# EAGLE design Logic Engine - Front LED (EAGLE 6.6.0)
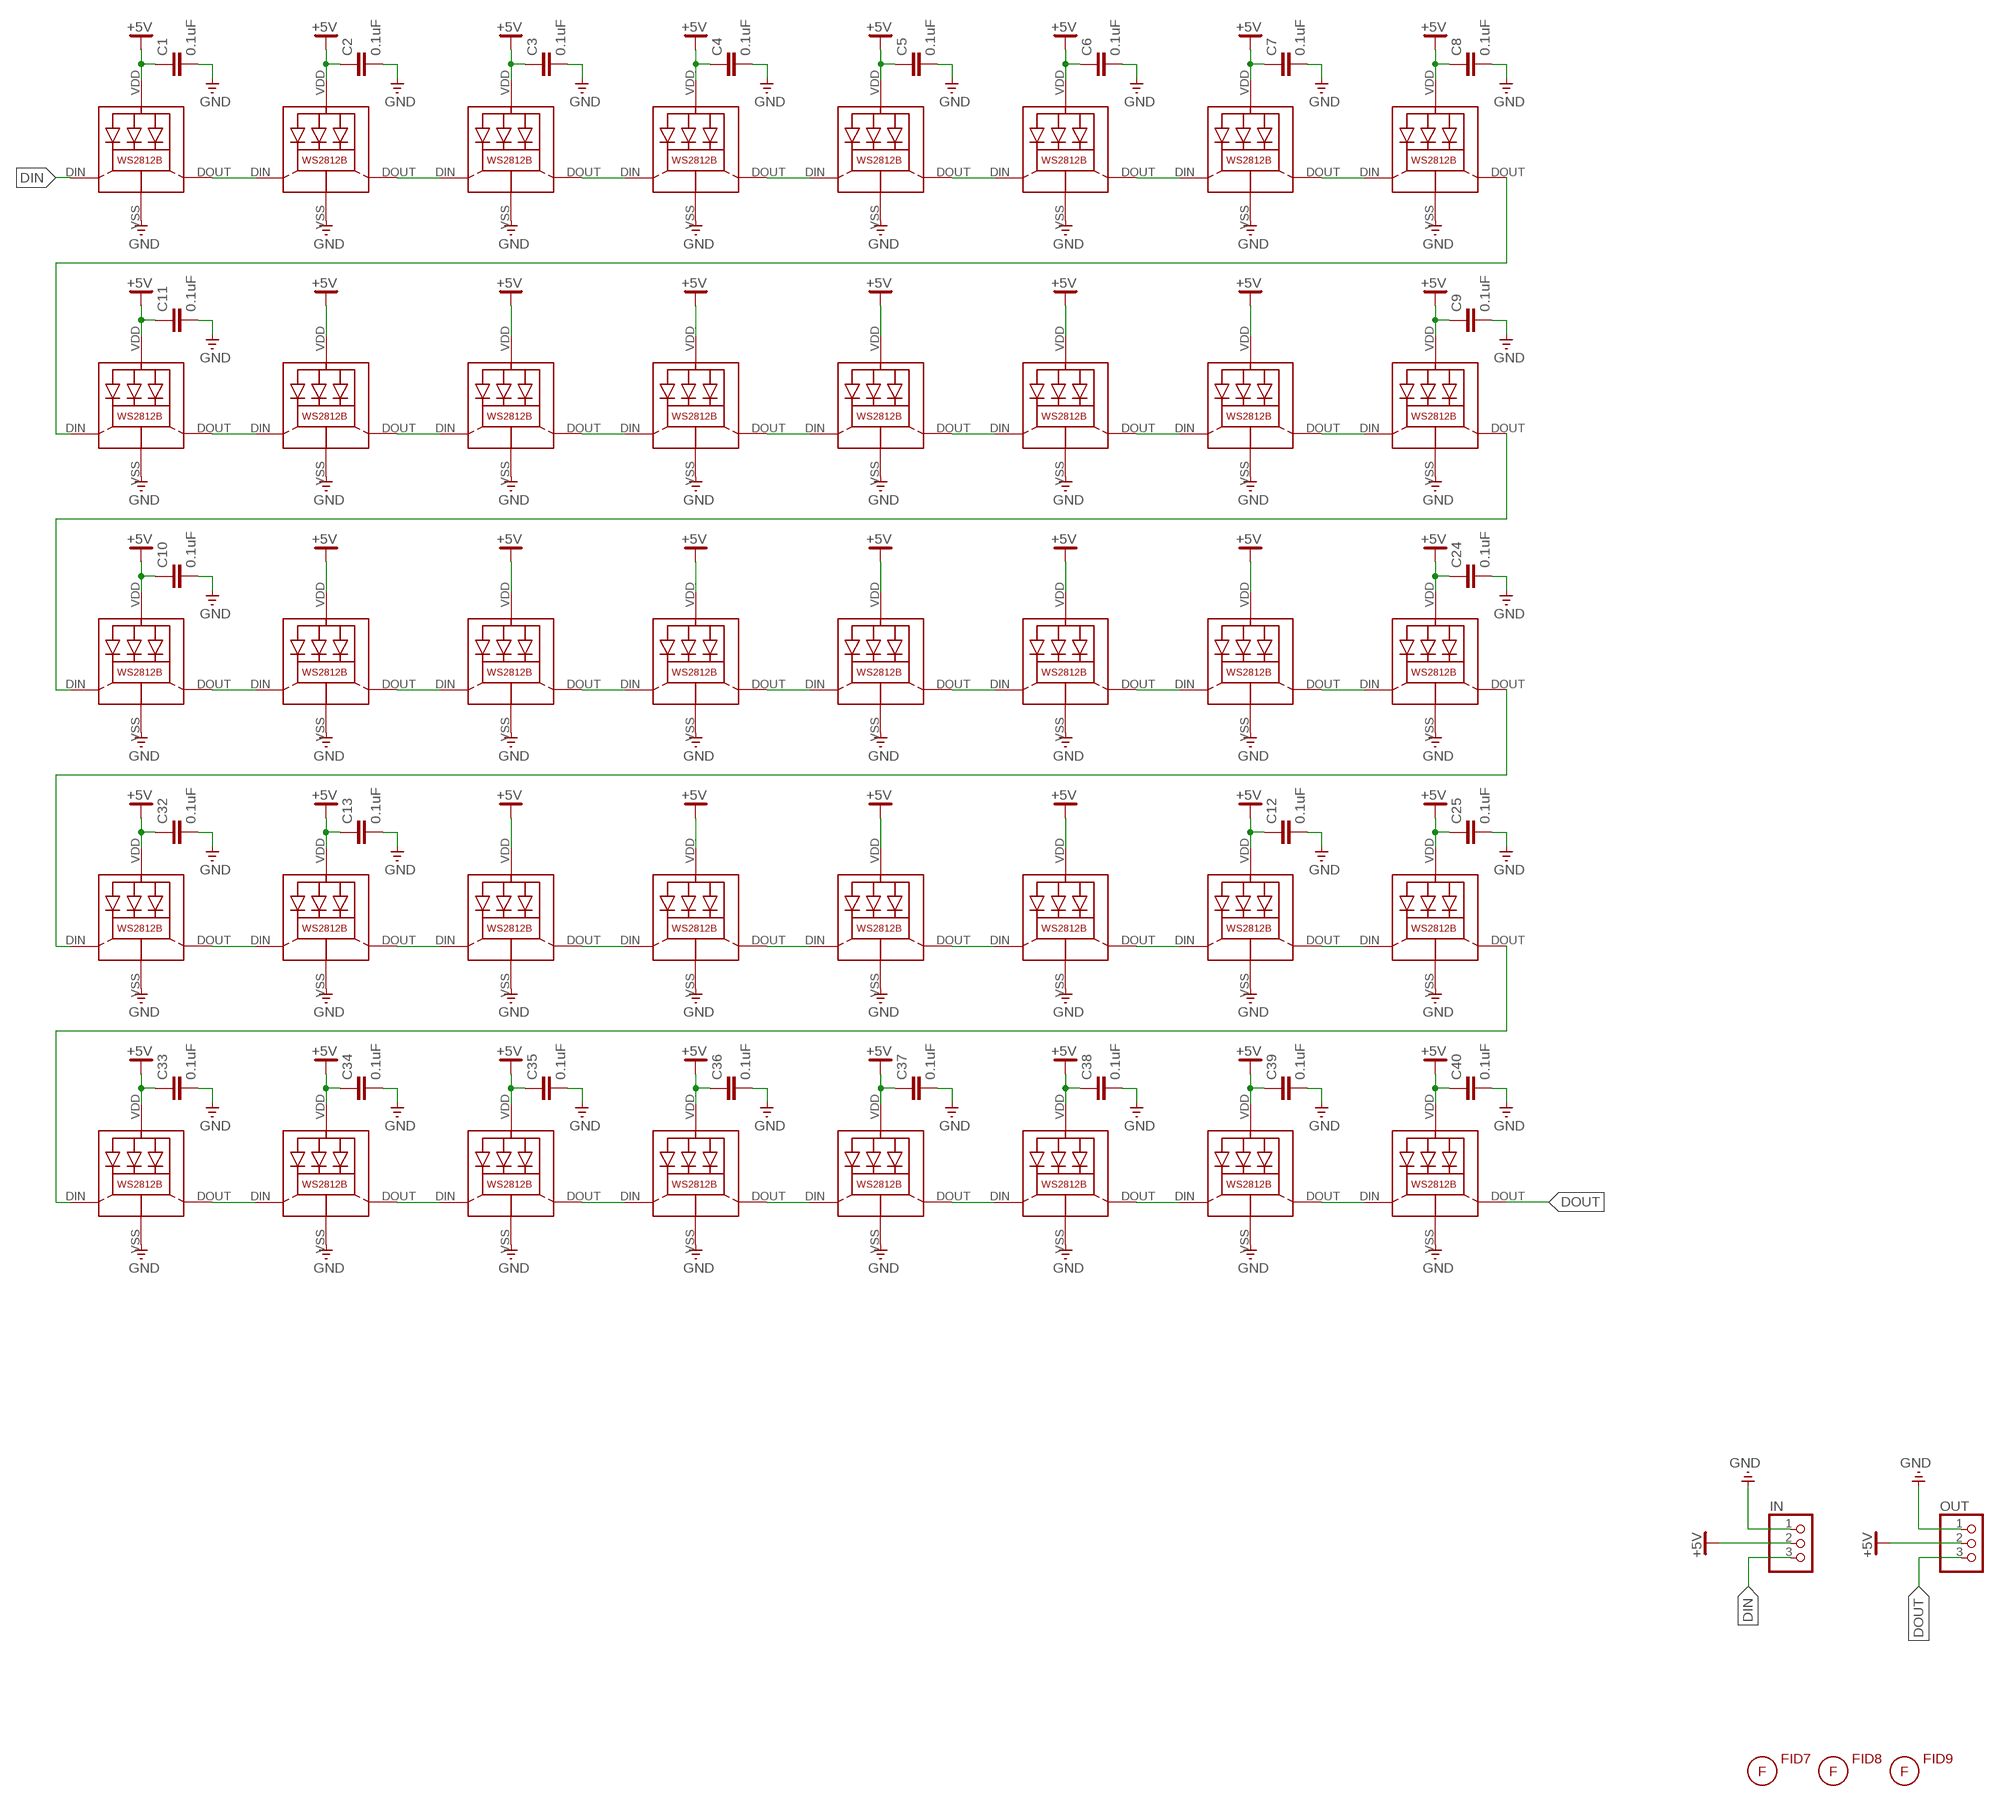
[diagram p0: schematic, sheet 1]

## Parts
C1  0.1uF  CAP0603-CAP  [0603-CAP]
C2  0.1uF  CAP0603-CAP  [0603-CAP]
C3  0.1uF  CAP0603-CAP  [0603-CAP]
C4  0.1uF  CAP0603-CAP  [0603-CAP]
C5  0.1uF  CAP0603-CAP  [0603-CAP]
C6  0.1uF  CAP0603-CAP  [0603-CAP]
C7  0.1uF  CAP0603-CAP  [0603-CAP]
C8  0.1uF  CAP0603-CAP  [0603-CAP]
C9  0.1uF  CAP0603-CAP  [0603-CAP]
C10  0.1uF  CAP0603-CAP  [0603-CAP]
C11  0.1uF  CAP0603-CAP  [0603-CAP]
C12  0.1uF  CAP0603-CAP  [0603-CAP]
C13  0.1uF  CAP0603-CAP  [0603-CAP]
C24  0.1uF  CAP0603-CAP  [0603-CAP]
C25  0.1uF  CAP0603-CAP  [0603-CAP]
C32  0.1uF  CAP0603-CAP  [0603-CAP]
C33  0.1uF  CAP0603-CAP  [0603-CAP]
C34  0.1uF  CAP0603-CAP  [0603-CAP]
C35  0.1uF  CAP0603-CAP  [0603-CAP]
C36  0.1uF  CAP0603-CAP  [0603-CAP]
C37  0.1uF  CAP0603-CAP  [0603-CAP]
C38  0.1uF  CAP0603-CAP  [0603-CAP]
C39  0.1uF  CAP0603-CAP  [0603-CAP]
C40  0.1uF  CAP0603-CAP  [0603-CAP]
FID7  FIDUCIAL  [FIDUCIAL_G15]
FID8  FIDUCIAL  [FIDUCIAL_G15]
FID9  FIDUCIAL  [FIDUCIAL_G15]
IN  PINHD-1X3  [1X03]
L1  WS2812B  [WS2812B]
L2  WS2812B  [WS2812B]
L3  WS2812B  [WS2812B]
L4  WS2812B  [WS2812B]
L5  WS2812B  [WS2812B]
L6  WS2812B  [WS2812B]
L7  WS2812B  [WS2812B]
L8  WS2812B  [WS2812B]
L9  WS2812B  [WS2812B]
L10  WS2812B  [WS2812B]
L11  WS2812B  [WS2812B]
L12  WS2812B  [WS2812B]
L13  WS2812B  [WS2812B]
L14  WS2812B  [WS2812B]
L15  WS2812B  [WS2812B]
L16  WS2812B  [WS2812B]
L17  WS2812B  [WS2812B]
L18  WS2812B  [WS2812B]
L19  WS2812B  [WS2812B]
L20  WS2812B  [WS2812B]
L21  WS2812B  [WS2812B]
L22  WS2812B  [WS2812B]
L23  WS2812B  [WS2812B]
L24  WS2812B  [WS2812B]
L25  WS2812B  [WS2812B]
L26  WS2812B  [WS2812B]
L27  WS2812B  [WS2812B]
L28  WS2812B  [WS2812B]
L29  WS2812B  [WS2812B]
L30  WS2812B  [WS2812B]
L31  WS2812B  [WS2812B]
L32  WS2812B  [WS2812B]
L33  WS2812B  [WS2812B]
L34  WS2812B  [WS2812B]
L35  WS2812B  [WS2812B]
L36  WS2812B  [WS2812B]
L37  WS2812B  [WS2812B]
L38  WS2812B  [WS2812B]
L39  WS2812B  [WS2812B]
L40  WS2812B  [WS2812B]
OUT  PINHD-1X3  [1X03]

## Nets
+5V [supply]: C1.1 C2.1 C3.1 C4.1 C5.1 C6.1 C7.1 C8.1 C9.1 C10.1 C11.1 C12.1 C13.1 C24.1 C25.1 C32.1 C33.1 C34.1 C35.1 C36.1 C37.1 C38.1 C39.1 C40.1 IN.2 L1.VDD L2.VDD L3.VDD L4.VDD L5.VDD L6.VDD L7.VDD L8.VDD L9.VDD L10.VDD L11.VDD L12.VDD L13.VDD L14.VDD L15.VDD L16.VDD L17.VDD L18.VDD L19.VDD L20.VDD L21.VDD L22.VDD L23.VDD L24.VDD L25.VDD L26.VDD L27.VDD L28.VDD L29.VDD L30.VDD L31.VDD L32.VDD L33.VDD L34.VDD L35.VDD L36.VDD L37.VDD L38.VDD L39.VDD L40.VDD OUT.2
DIN: IN.3 L1.DIN(DI)
DOUT: L40.DOUT(DO) OUT.3
GND [supply]: C1.2 C2.2 C3.2 C4.2 C5.2 C6.2 C7.2 C8.2 C9.2 C10.2 C11.2 C12.2 C13.2 C24.2 C25.2 C32.2 C33.2 C34.2 C35.2 C36.2 C37.2 C38.2 C39.2 C40.2 IN.1 L1.VSS(GND) L2.VSS(GND) L3.VSS(GND) L4.VSS(GND) L5.VSS(GND) L6.VSS(GND) L7.VSS(GND) L8.VSS(GND) L9.VSS(GND) L10.VSS(GND) L11.VSS(GND) L12.VSS(GND) L13.VSS(GND) L14.VSS(GND) L15.VSS(GND) L16.VSS(GND) L17.VSS(GND) L18.VSS(GND) L19.VSS(GND) L20.VSS(GND) L21.VSS(GND) L22.VSS(GND) L23.VSS(GND) L24.VSS(GND) L25.VSS(GND) L26.VSS(GND) L27.VSS(GND) L28.VSS(GND) L29.VSS(GND) L30.VSS(GND) L31.VSS(GND) L32.VSS(GND) L33.VSS(GND) L34.VSS(GND) L35.VSS(GND) L36.VSS(GND) L37.VSS(GND) L38.VSS(GND) L39.VSS(GND) L40.VSS(GND) OUT.1
N$1: L9.DOUT(DO) L10.DIN(DI)
N$2: L10.DOUT(DO) L11.DIN(DI)
N$3: L11.DOUT(DO) L12.DIN(DI)
N$4: L12.DOUT(DO) L13.DIN(DI)
N$5: L13.DOUT(DO) L14.DIN(DI)
N$6: L14.DOUT(DO) L15.DIN(DI)
N$7: L15.DOUT(DO) L16.DIN(DI)
N$8: L17.DOUT(DO) L18.DIN(DI)
N$9: L18.DOUT(DO) L19.DIN(DI)
N$10: L19.DOUT(DO) L20.DIN(DI)
N$11: L20.DOUT(DO) L21.DIN(DI)
N$12: L21.DOUT(DO) L22.DIN(DI)
N$13: L22.DOUT(DO) L23.DIN(DI)
N$14: L23.DOUT(DO) L24.DIN(DI)
N$15: L25.DOUT(DO) L26.DIN(DI)
N$16: L26.DOUT(DO) L27.DIN(DI)
N$17: L27.DOUT(DO) L28.DIN(DI)
N$18: L28.DOUT(DO) L29.DIN(DI)
N$19: L29.DOUT(DO) L30.DIN(DI)
N$20: L30.DOUT(DO) L31.DIN(DI)
N$21: L31.DOUT(DO) L32.DIN(DI)
N$22: L33.DOUT(DO) L34.DIN(DI)
N$23: L34.DOUT(DO) L35.DIN(DI)
N$24: L35.DOUT(DO) L36.DIN(DI)
N$25: L36.DOUT(DO) L37.DIN(DI)
N$26: L37.DOUT(DO) L38.DIN(DI)
N$27: L38.DOUT(DO) L39.DIN(DI)
N$28: L39.DOUT(DO) L40.DIN(DI)
N$29: L8.DOUT(DO) L9.DIN(DI)
N$30: L16.DOUT(DO) L17.DIN(DI)
N$31: L24.DOUT(DO) L25.DIN(DI)
N$32: L32.DOUT(DO) L33.DIN(DI)
N$40: L1.DOUT(DO) L2.DIN(DI)
N$41: L2.DOUT(DO) L3.DIN(DI)
N$42: L3.DOUT(DO) L4.DIN(DI)
N$43: L4.DOUT(DO) L5.DIN(DI)
N$44: L5.DOUT(DO) L6.DIN(DI)
N$45: L6.DOUT(DO) L7.DIN(DI)
N$46: L7.DOUT(DO) L8.DIN(DI)

## Library data of the parts
C1-C13 C24 C25 C32-C40 = SparkFun-Capacitors:CAP: Capacitor Standard 0603 ceramic capacitor, and 0.1" leaded capacitor.
FID7-FID9 = SmallBatchLibPre1:FIDUCIAL
IN OUT = adafruit:PINHD-1X3: PIN HEADER
L1-L40 = rseries:WS2812B: WS2812B is the 4-pin variant of the WS2812 http://www.mikrocontroller.net/attachment/180459/WS2812B_preliminary.pdf based on WS2812 from https://github.com/adafruit/Adafruit-Eagle-Library

## Net classes
1 supply: width 0.406 mm, drill 0.33 mm, clearance 0.203 mm

## Board
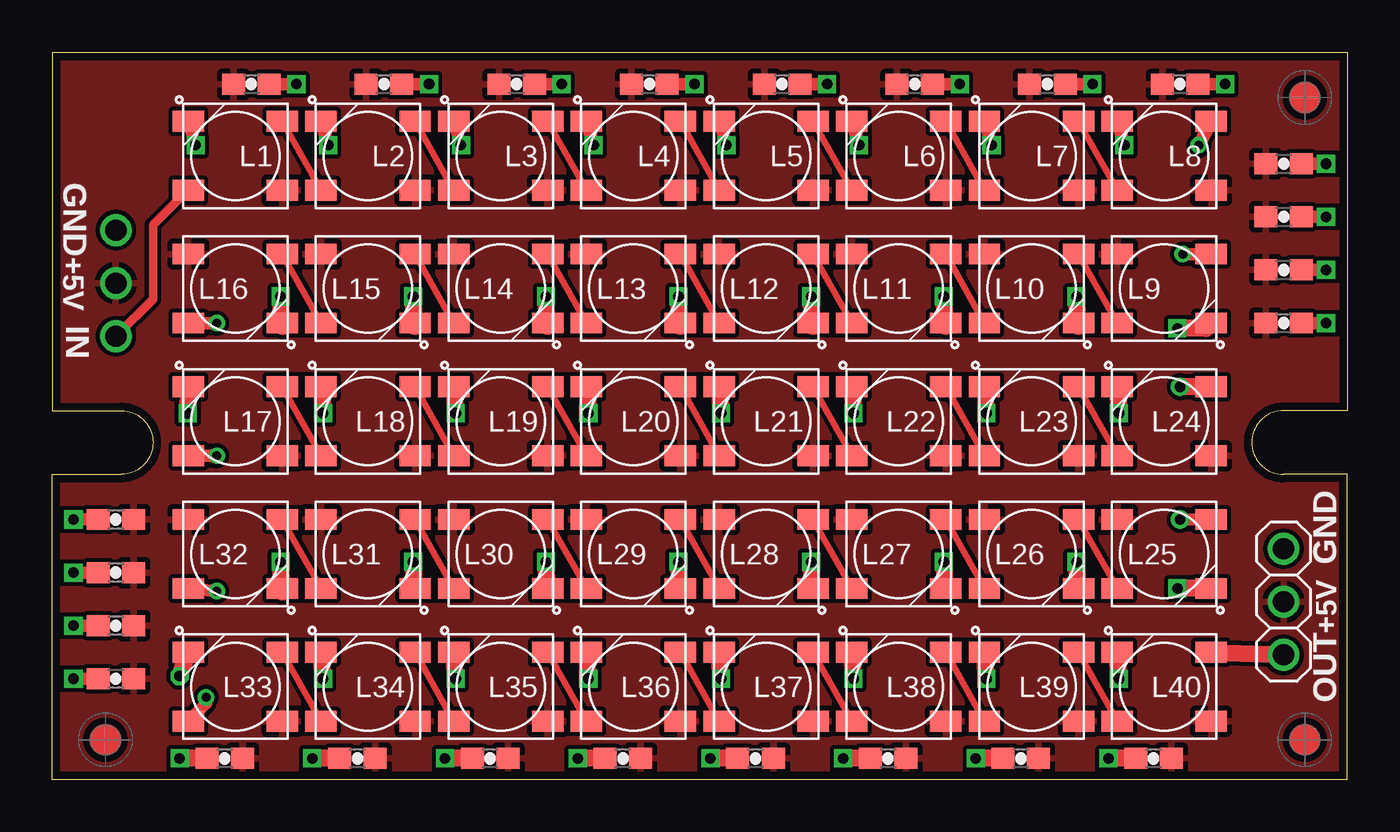
[diagram p1: board, top side]
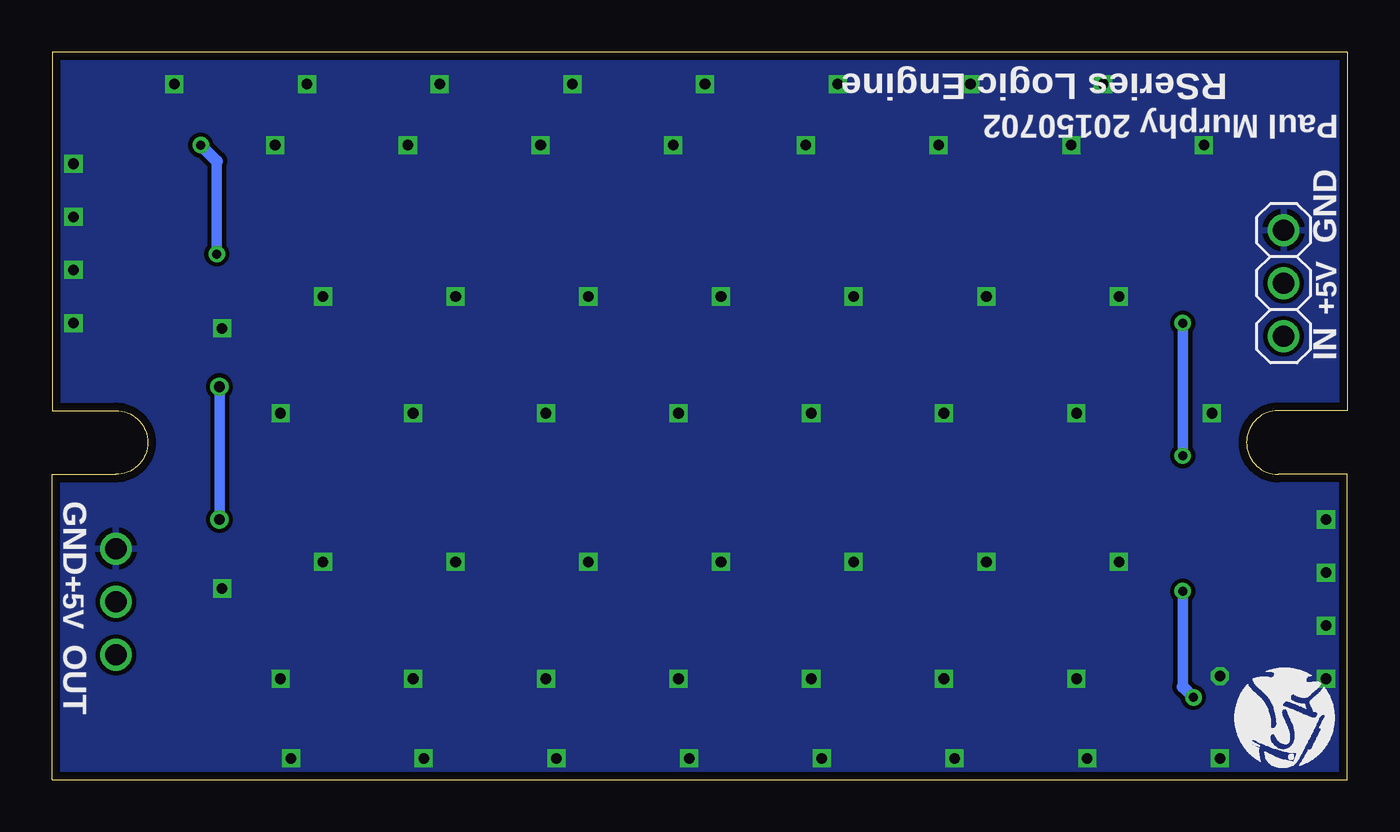
[diagram p2: board, bottom side, seen from below]

Size 61.98 x 34.8 mm. Coordinates in mm from the lower left corner, seen from the top.
Outline: 0,34.8 61.98,34.8 61.98,17.65 58.93,17.65 arc90 57.4,16.13 arc90 58.93,14.61 61.98,14.61 61.98,0 0,0 0,14.61 3.3,14.61 arc90 4.83,16.13 arc90 3.3,17.65 0,17.65 0,34.8
Copper layers (1*16): Top 0.0356mm / dielectric 1.5011mm / Bottom 0.0356mm
Design rules "LaenPCBOrder *": minimum track width 10mil, minimum drill 13mil, track to track 6mil, track to pad 6mil, pad to pad 6mil, via to via 6mil, smd to smd 6mil, copper to edge 15mil, drill to drill 6mil, minimum pad ring 7mil, minimum via ring 7mil, stop-mask expansion 4mil, vias tented up to drill 24mil, thermal gap 10mil

### Footprints (pad centres in the part's own frame; a part is rotated, then mirrored left to right if it is on the bottom)
0603-CAP = smd 1.1 x 1: 1 -0.85,0; 2 0.85,0
1X03 = drill 1.016: 1 -2.54,0; 2 0,0; 3 2.54,0
WS2812B = smd 1.5 x 1: DIN 2.25,1.65; DOUT -2.25,-1.65; VDD -2.25,1.65; VSS 2.25,-1.65

### Placement (x,y rotation side)
C1  9.53,33.27 0 top
C2  15.88,33.27 0 top
C3  22.23,33.27 0 top
C4  28.57,33.27 0 top
C5  34.92,33.27 0 top
C6  41.27,33.27 0 top
C7  47.62,33.27 0 top
C8  53.98,33.27 0 top
C9  58.93,29.46 0 top
C10  3.05,12.45 180 top
C11  3.05,7.37 180 top
C12  58.93,21.84 0 top
C13  3.05,9.91 180 top
C24  58.93,26.92 0 top
C25  58.93,24.38 0 top
C32  3.05,4.83 180 top
C33  8.26,1.02 180 top
C34  14.61,1.02 180 top
C35  20.95,1.02 180 top
C36  27.3,1.02 180 top
C37  33.66,1.02 180 top
C38  40.01,1.02 180 top
C39  46.35,1.02 180 top
C40  52.7,1.02 180 top
FID7  2.54,1.91 0 top
FID8  59.94,32.64 0 top
FID9  59.94,1.91 0 top
IN  3.05,23.75 270 bottom
L1  8.76,29.84 180 top
L2  15.11,29.84 180 top
L3  21.46,29.84 180 top
L4  27.81,29.84 180 top
L5  34.16,29.84 180 top
L6  40.51,29.84 180 top
L7  46.86,29.84 180 top
L8  53.21,29.84 180 top
L9  53.21,23.5 0 top
L10  46.86,23.5 0 top
L11  40.51,23.5 0 top
L12  34.16,23.5 0 top
L13  27.81,23.5 0 top
L14  21.46,23.5 0 top
L15  15.11,23.5 0 top
L16  8.76,23.5 0 top
L17  8.76,17.14 180 top
L18  15.11,17.14 180 top
L19  21.46,17.14 180 top
L20  27.81,17.14 180 top
L21  34.16,17.14 180 top
L22  40.51,17.14 180 top
L23  46.86,17.14 180 top
L24  53.21,17.14 180 top
L25  53.21,10.79 0 top
L26  46.86,10.79 0 top
L27  40.51,10.79 0 top
L28  34.16,10.79 0 top
L29  27.81,10.79 0 top
L30  21.46,10.79 0 top
L31  15.11,10.79 0 top
L32  8.76,10.79 0 top
L33  8.76,4.45 180 top
L34  15.11,4.45 180 top
L35  21.46,4.45 180 top
L36  27.81,4.45 180 top
L37  34.16,4.45 180 top
L38  40.51,4.45 180 top
L39  46.86,4.45 180 top
L40  53.21,4.45 180 top
OUT  58.93,8.51 270 top
U$2  [R2BUILDERS-LOGO]  0.51,5.46 180 bottom

### Tracks (layer width: path | path; a pad name or v marks a point on that pad's centre or on a via)
+5V
  pour Top: -1.78,39.37 63.5,39.37 63.5,-1.02 -1.78,-1.02
DIN
  Top 0.406: IN.3 4.83,22.99 4.83,26.54 6.48,28.2 L1.DIN
DOUT
  Top 0.813: L40.DOUT OUT.3
GND  (via drill 0.51)
  Top 0.61: L1.VSS v6.86,30.35 | L2.VSS v13.21,30.35 | L3.VSS v19.56,30.35 | L4.VSS v25.91,30.35 | L5.VSS v32.26,30.35 | L6.VSS v38.61,30.35 | L7.VSS v44.96,30.35 | L8.VSS v51.31,30.35 | C12.2 v60.96,21.84 | C24.2 v60.96,26.92 | C9.2 v60.96,29.46 | C25.2 v60.96,24.38 | C10.2 v1.02,12.45 | C11.2 v1.02,7.37 | C32.2 v1.02,4.83 | C13.2 v1.02,9.91 | C8.2 v56.13,33.27 | C7.2 v49.78,33.27 | C6.2 v43.43,33.27 | C5.2 v37.08,33.27 | C4.2 v30.73,33.27 | C3.2 v24.38,33.27 | C2.2 v18.03,33.27 | C1.2 v11.68,33.27
  Top 0.813: L16.VSS 11.01,21.68 v10.92,23.11 | L15.VSS 17.36,21.68 v17.27,23.11 | L14.VSS 23.71,21.68 v23.62,23.11 | L13.VSS 30.06,21.68 v29.97,23.11 | L12.VSS 36.41,21.68 v36.32,23.11 | L11.VSS 42.76,21.68 v42.67,23.11 | L10.VSS 49.11,21.68 v49.02,23.11 | 11.01,8.98 L32.VSS v10.92,10.41 | L25.VSS v53.85,9.14 | L9.VSS 55.21,21.59 v53.85,21.59 | v51.05,4.83 L40.VSS | v44.7,4.83 L39.VSS | v38.35,4.83 L38.VSS | v32,4.83 L37.VSS | v25.65,4.83 L36.VSS | v19.3,4.83 L35.VSS | v12.95,4.83 L34.VSS | v6.1,4.95 L33.VSS | C40.2 v50.55,1.02 | C39.2 v44.2,1.02 | C38.2 v37.85,1.02 | C37.2 v31.5,1.02 | C36.2 v25.15,1.02 | C35.2 v18.8,1.02 | C34.2 v12.45,1.02 | C33.2 v6.1,1.02 | L17.VSS v6.48,17.53 | L18.VSS v12.95,17.53 | L24.VSS v51.05,17.53 | L23.VSS v44.7,17.53 | L22.VSS v38.35,17.53 | L21.VSS v32,17.53 | L20.VSS v25.65,17.53 | L19.VSS v19.3,17.53 | L31.VSS v17.27,10.41 | L30.VSS v23.62,10.41 | L29.VSS v29.97,10.41 | L28.VSS v36.32,10.41 | L27.VSS v42.67,10.41 | L26.VSS v49.02,10.41
  pour Bottom: -3.56,41.15 65.02,41.15 64.77,-2.29 -3.81,-2.29
N$1
  Top 0.305: L10.DIN L9.DOUT
N$2
  Top 0.305: L11.DIN L10.DOUT
N$3
  Top 0.305: L12.DIN L11.DOUT
N$4
  Top 0.305: L13.DIN L12.DOUT
N$5
  Top 0.305: L14.DIN L13.DOUT
N$6
  Top 0.305: L15.DIN L14.DOUT
N$7
  Top 0.305: L16.DIN L15.DOUT
N$8
  Top 0.305: L17.DOUT L18.DIN
N$9
  Top 0.305: L18.DOUT L19.DIN
N$10
  Top 0.305: L19.DOUT L20.DIN
N$11
  Top 0.305: L20.DOUT L21.DIN
N$12
  Top 0.305: L21.DOUT L22.DIN
N$13
  Top 0.305: L22.DOUT L23.DIN
N$14
  Top 0.305: L23.DOUT L24.DIN
N$15
  Top 0.305: L26.DIN L25.DOUT
N$16
  Top 0.305: L27.DIN L26.DOUT
N$17
  Top 0.305: L28.DIN L27.DOUT
N$18
  Top 0.305: L29.DIN L28.DOUT
N$19
  Top 0.305: L30.DIN L29.DOUT
N$20
  Top 0.305: L31.DIN L30.DOUT
N$21
  Top 0.305: L32.DIN L31.DOUT
N$22
  Top 0.305: L33.DOUT L34.DIN
N$23
  Top 0.305: L34.DOUT L35.DIN
N$24
  Top 0.305: L35.DOUT L36.DIN
N$25
  Top 0.305: L36.DOUT L37.DIN
N$26
  Top 0.305: L37.DOUT L38.DIN
N$27
  Top 0.305: L38.DOUT L39.DIN
N$28
  Top 0.305: L39.DOUT L40.DIN
N$29  (via drill 0.43)
  Top 0.61: v54.1,25.15 L9.DIN | v54.86,30.35 L8.DOUT
  Bottom 0.508: 54.1,29.59 v54.1,25.15
  Bottom 0.61: v54.86,30.35 54.1,29.59
N$30  (via drill 0.43)
  Top 0.61: v7.87,15.49 L17.DIN | v7.87,21.84 L16.DOUT
  Bottom 0.508: v7.87,21.84 v7.87,15.49
N$31  (via drill 0.51)
  Top 0.61: v53.98,12.45 L25.DIN
  Top 0.813: L24.DOUT v53.98,18.8
  Bottom 0.508: v53.98,18.8 v53.98,12.45
N$32  (via drill 0.43)
  Top 0.61: L32.DOUT v7.87,9.02 | L33.DIN 7.37,3.65 v7.37,3.94
  Bottom 0.508: 7.87,4.45 v7.87,9.02
  Bottom 0.61: 7.87,4.45 v7.37,3.94
N$40
  Top 0.305: L1.DOUT L2.DIN
N$41
  Top 0.305: L2.DOUT L3.DIN
N$42
  Top 0.305: L3.DOUT L4.DIN
N$43
  Top 0.305: L4.DOUT L5.DIN
N$44
  Top 0.305: L5.DOUT L6.DIN
N$45
  Top 0.305: L6.DOUT L7.DIN
N$46
  Top 0.305: L7.DOUT L8.DIN

### Text on the board
tPlace: GND | +5V | IN | GND | +5V | OUT
bNames: RSeries Logic Engine | Paul Murphy 20150702 | GND | +5V | GND | +5V
tDocu: v7.1 : mounting holes and pin headers moved down .04 inches / top board outline raised 0.02 inches